# EAGLE board DF32-revision-B (EAGLE 6.6.0), part 1 of 3
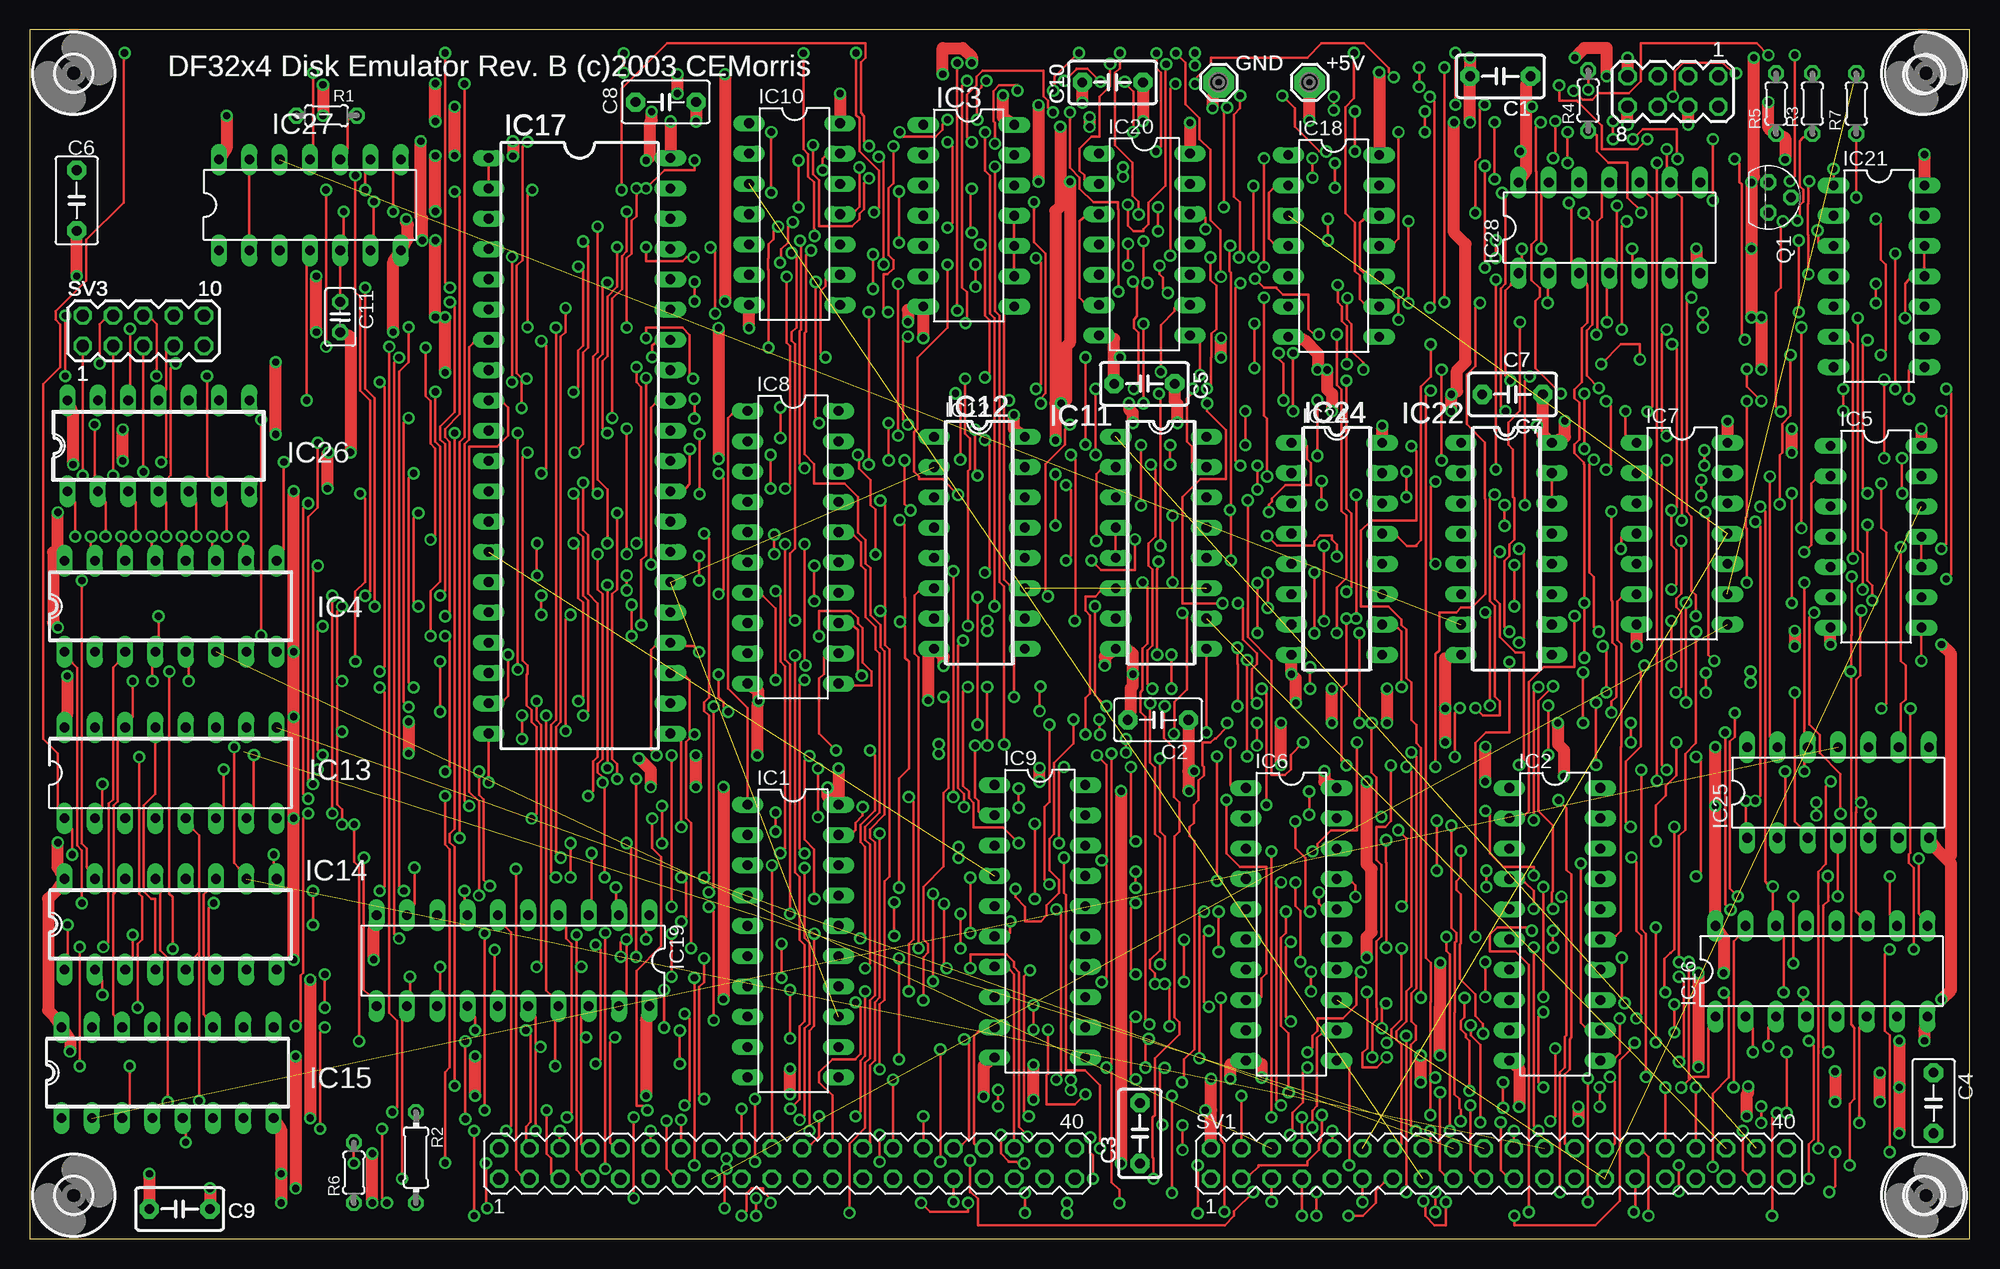
[diagram p2: board, top side]
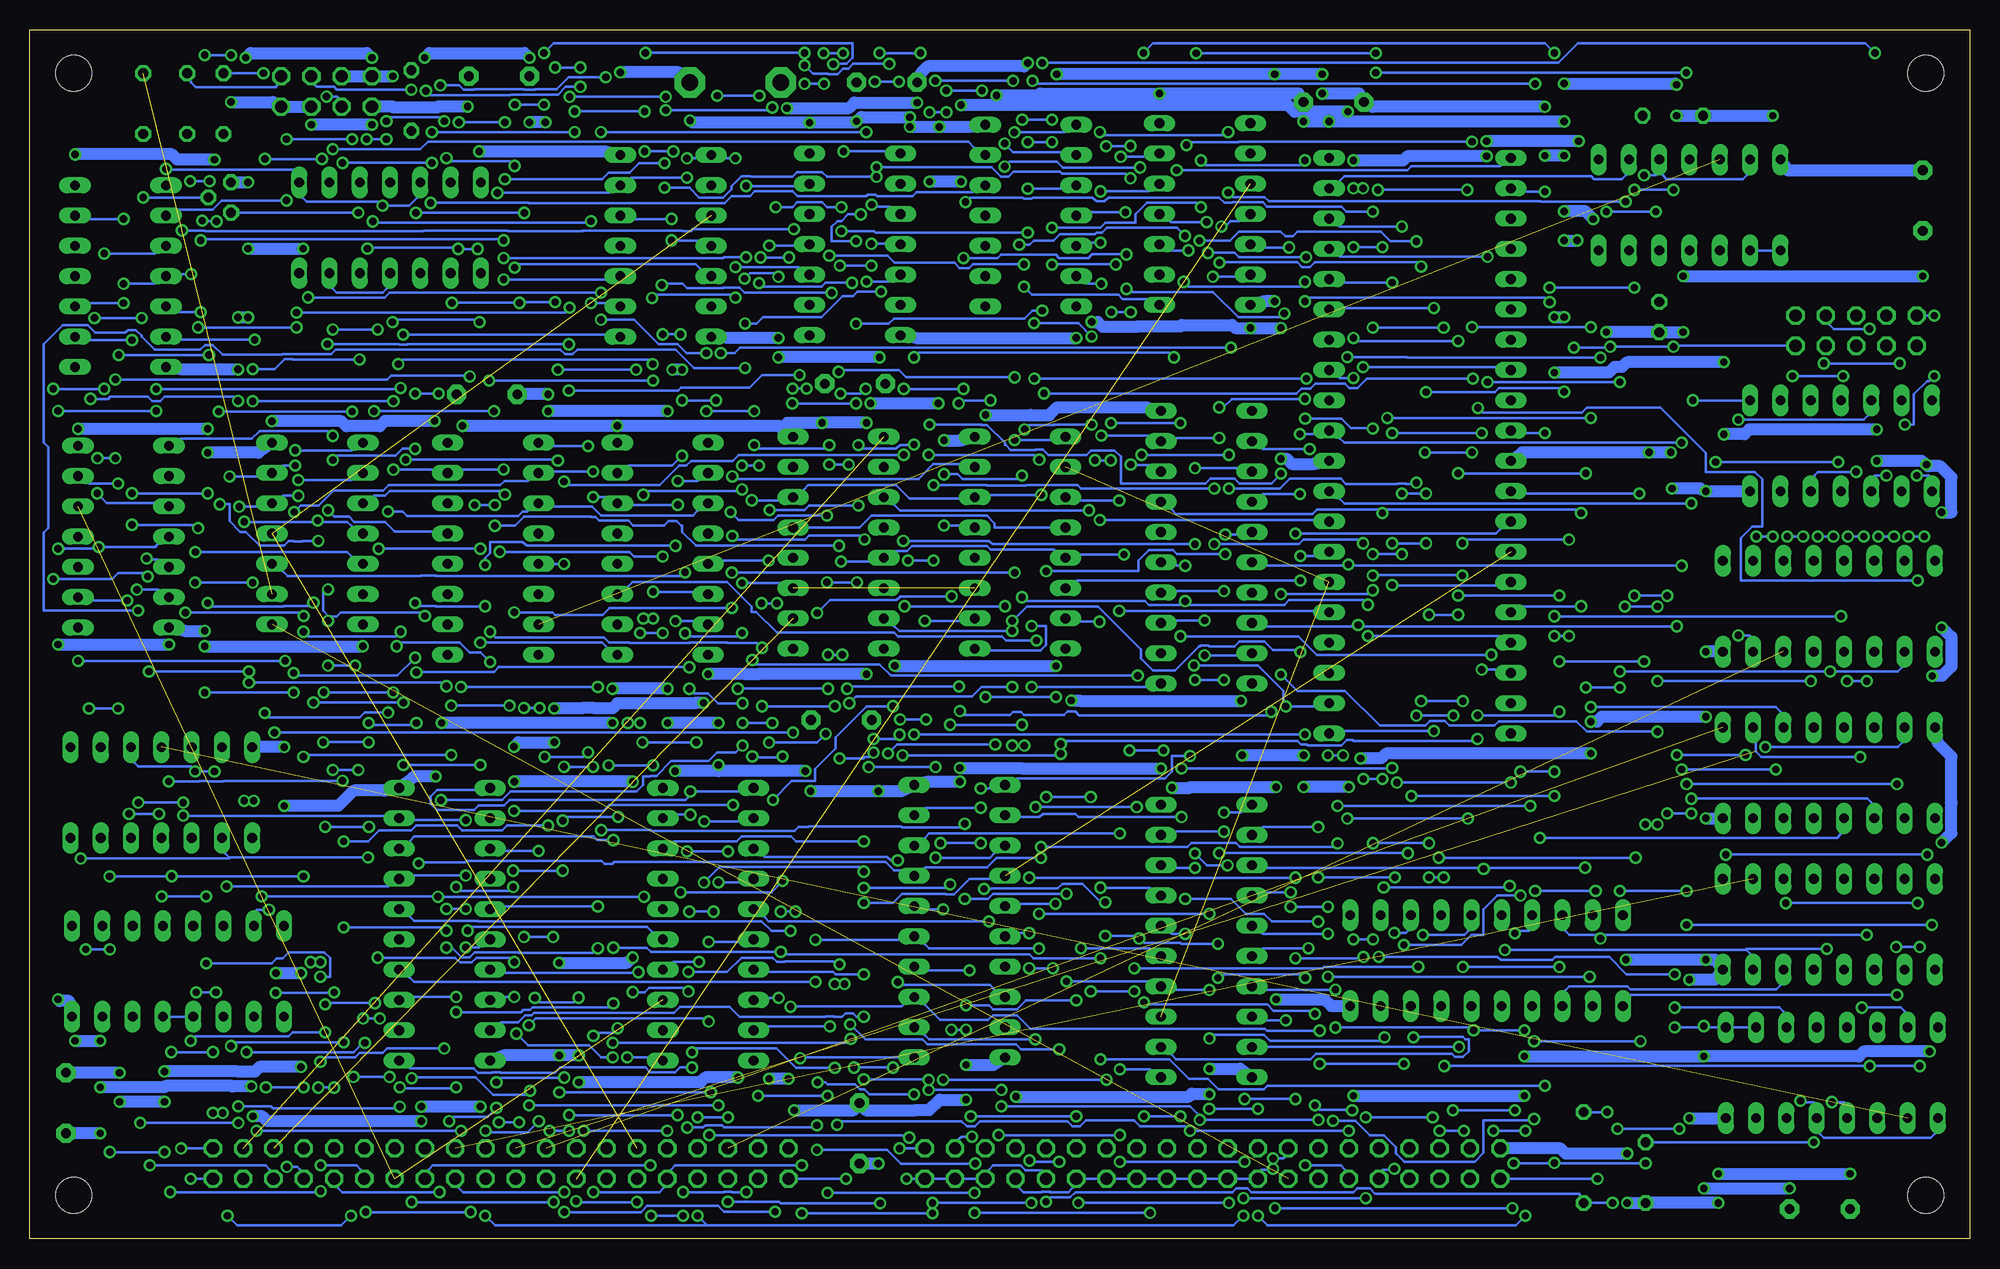
[diagram p3: board, bottom side, seen from below]

Size 162.67 x 101.4 mm. Coordinates in mm from the lower left corner, seen from the top.
Outline: 0,0 162.67,0 162.67,101.4 0,101.4 0,0
Copper layers (1*16): Top 0.035mm / dielectric 1.5mm / Bottom 0.035mm
Design rules "default *": minimum track width 8mil, minimum drill 24mil, track to track 8mil, track to pad 8mil, pad to pad 8mil, via to via 8mil, smd to smd 8mil, copper to edge 40mil, drill to drill 8mil, minimum pad ring 10mil, minimum via ring 8mil, stop-mask expansion 4mil, vias tented up to drill 0mil, thermal gap 10mil
Net classes: 1 supply: width 1.016 mm

## Footprints (pad centres in the part's own frame; a part is rotated, then mirrored left to right if it is on the bottom)
SE14 = drill 1.397 pad 2.54 octagon: MP 0,0
C5B3.5 = drill 0.813 pad 1.6 octagon: 1 -2.54,0; 2 2.54,0
C025-025X050 = drill 0.813 octagon: 1 -1.27,0; 2 1.27,0
DIL20 = drill 0.813 long: 1 -11.43,-3.81; 2 -8.89,-3.81; 3 -6.35,-3.81; 4 -3.81,-3.81; 5 -1.27,-3.81; 6 1.27,-3.81; 7 3.81,-3.81; 8 6.35,-3.81; 9 8.89,-3.81; 10 11.43,-3.81; 11 11.43,3.81; 12 8.89,3.81; 13 6.35,3.81; 14 3.81,3.81; 15 1.27,3.81; 16 -1.27,3.81; 17 -3.81,3.81; 18 -6.35,3.81; 19 -8.89,3.81; 20 -11.43,3.81
DIL14 = drill 0.813 long: 1 -7.62,-3.81; 2 -5.08,-3.81; 3 -2.54,-3.81; 4 0,-3.81; 5 2.54,-3.81; 6 5.08,-3.81; 7 7.62,-3.81; 8 7.62,3.81; 9 5.08,3.81; 10 2.54,3.81; 11 0,3.81; 12 -2.54,3.81; 13 -5.08,3.81; 14 -7.62,3.81
DIL16 = drill 0.813 long: 1 -8.89,-3.81; 2 -6.35,-3.81; 3 -3.81,-3.81; 4 -1.27,-3.81; 5 1.27,-3.81; 6 3.81,-3.81; 7 6.35,-3.81; 8 8.89,-3.81; 9 8.89,3.81; 10 6.35,3.81; 11 3.81,3.81; 12 1.27,3.81; 13 -1.27,3.81; 14 -3.81,3.81; 15 -6.35,3.81; 16 -8.89,3.81
DIL40 = drill 0.813 long: 1 -24.13,-7.62; 2 -21.59,-7.62; 3 -19.05,-7.62; 4 -16.51,-7.62; 5 -13.97,-7.62; 6 -11.43,-7.62; 7 -8.89,-7.62; 8 -6.35,-7.62; 9 -3.81,-7.62; 10 -1.27,-7.62; 11 1.27,-7.62; 12 3.81,-7.62; 13 6.35,-7.62; 14 8.89,-7.62; 15 11.43,-7.62; 16 13.97,-7.62; 17 16.51,-7.62; 18 19.05,-7.62; 19 21.59,-7.62; 20 24.13,-7.62; 21 24.13,7.62; 22 21.59,7.62; 23 19.05,7.62; 24 16.51,7.62; 25 13.97,7.62; 26 11.43,7.62; 27 8.89,7.62; 28 6.35,7.62; 29 3.81,7.62; 30 1.27,7.62; 31 -1.27,7.62; 32 -3.81,7.62; 33 -6.35,7.62; 34 -8.89,7.62; 35 -11.43,7.62; 36 -13.97,7.62; 37 -16.51,7.62; 38 -19.05,7.62; 39 -21.59,7.62; 40 -24.13,7.62
TO92 = drill 0.813 octagon: 1 1.27,0; 2 0,1.905; 3 -1.27,0
0204/5 = drill 0.813 octagon: 1 -2.54,0; 2 2.54,0
0204/7 = drill 0.813 octagon: 1 -3.81,0; 2 3.81,0
MA20-2 = drill 1.016 octagon: 1 -24.13,-1.27; 2 -24.13,1.27; 3 -21.59,-1.27; 4 -21.59,1.27; 5 -19.05,-1.27; 6 -19.05,1.27; 7 -16.51,-1.27; 8 -16.51,1.27; 9 -13.97,-1.27; 10 -13.97,1.27; 11 -11.43,-1.27; 12 -11.43,1.27; 13 -8.89,-1.27; 14 -8.89,1.27; 15 -6.35,-1.27; 16 -6.35,1.27; 17 -3.81,-1.27; 18 -3.81,1.27; 19 -1.27,-1.27; 20 -1.27,1.27; 21 1.27,-1.27; 22 1.27,1.27; 23 3.81,-1.27; 24 3.81,1.27; 25 6.35,-1.27; 26 6.35,1.27; 27 8.89,-1.27; 28 8.89,1.27; 29 11.43,-1.27; 30 11.43,1.27; 31 13.97,-1.27; 32 13.97,1.27; 33 16.51,-1.27; 34 16.51,1.27; 35 19.05,-1.27; 36 19.05,1.27; 37 21.59,-1.27; 38 21.59,1.27; 39 24.13,-1.27; 40 24.13,1.27
MA05-2 = drill 1.016 octagon: 1 -5.08,-1.27; 2 -5.08,1.27; 3 -2.54,-1.27; 4 -2.54,1.27; 5 0,-1.27; 6 0,1.27; 7 2.54,-1.27; 8 2.54,1.27; 9 5.08,-1.27; 10 5.08,1.27
MA04-2 = drill 1.016 octagon: 1 -3.81,-1.27; 2 -3.81,1.27; 3 -1.27,-1.27; 4 -1.27,1.27; 5 1.27,-1.27; 6 1.27,1.27; 7 3.81,-1.27; 8 3.81,1.27
3,0 = hole 3: 0,0

## Placement (x,y rotation side)
+5V  SE14  [SE14]  107.31,96.99 0 top
C1  [C5B3.5]  123.31,97.5 180 top
C2  [C5B3.5]  94.61,43.52 180 top
C3  [C5B3.5]  93.09,8.85 90 top
C4  [C5B3.5]  159.63,11.39 270 top
C5  [C5B3.5]  93.47,71.72 180 top
C6  [C5B3.5]  3.93,87.08 270 top
C7  [C5B3.5]  124.33,70.83 180 top
C8  [C5B3.5]  53.34,95.34 180 top
C9  [C5B3.5]  12.57,2.5 180 top
C10  [C5B3.5]  90.8,96.99 180 top
C11  [C025-025X050]  26.03,77.31 270 top
GND  SE14  [SE14]  99.69,96.99 0 top
IC1  74LS240N  [DIL20]  64,24.98 270 top
IC2  74LS244N  [DIL20]  127.88,26.38 270 top
IC3  74LS00N  [DIL14]  78.73,85.81 270 top
IC4  74LS138N  [DIL16]  11.81,53.05 0 top
IC5  74LS32N  [DIL14]  154.81,58.89 270 top
IC6  74LS244N  [DIL20]  105.79,26.38 270 top
IC7  74LS74N  [DIL14]  138.55,59.14 270 top
IC8  74LS240N  [DIL20]  64,58 270 top
IC9  74LS240N  [DIL20]  84.7,26.63 270 top
IC10  74LS04N  [DIL14]  64.13,85.94 270 top
IC11  74LS191N  [DIL16]  94.86,58.38 270 top
IC12  74LS191N  [DIL16]  79.62,58.38 270 top
IC13  74LS191N  [DIL16]  11.81,39.08 0 top
IC14  74LS191N  [DIL16]  11.81,26.38 0 top
IC15  74LS191N  [DIL16]  11.55,13.93 0 top
IC16  74LS191N  [DIL16]  150.24,22.44 0 top
IC17  DS1258  [DIL40]  46.1,66.51 270 top
IC18  74LS74N  [DIL14]  109.34,83.27 270 top
IC19  74LS240N  [DIL20]  40.51,23.33 180 top
IC20  74LS02N  [DIL14]  93.47,83.4 270 top
IC21  74LS01N  [DIL14]  155.06,80.73 270 top
IC22  74LS155N  [DIL16]  123.82,57.87 270 top
IC24  74LS155N  [DIL16]  109.6,57.87 270 top
IC25  74LS74N  [DIL14]  151.63,37.43 0 top
IC26  74LS30N  [DIL14]  10.79,66.51 0 top
IC27  74LS86N  [DIL14]  23.49,86.7 0 top
IC28  74LS07N  [DIL14]  132.46,84.8 0 top
Q1  2N3904  [TO92]  145.79,87.34 270 top
R1  1K  [0204/5]  24.89,94.2 0 top
R2  1K  [0204/7]  32.38,6.82 270 top
R3  220  [0204/5]  149.47,95.21 90 top
R4  220  [0204/5]  130.68,95.47 90 top
R5  220  [0204/5]  146.43,95.21 270 top
R6  0  [0204/5]  27.17,5.55 90 top
R7  4.7K  [0204/5]  153.16,95.21 270 top
SV1  BUS1  [MA20-2]  123.19,6.31 0 top
SV2  BUS2  [MA20-2]  63.49,6.31 0 top
SV3  WRLOCK  [MA05-2]  9.52,76.16 0 top
SV4  PANEL LEDS  [MA04-2]  137.79,96.23 180 top
U$1  [3,0]  3.68,97.75 0 top
U$2  [3,0]  3.68,3.65 0 top
U$3  [3,0]  159,3.65 0 top
U$4  [3,0]  159,97.75 0 top

## Tracks (layer width: path | path; a pad name or v marks a point on that pad's centre or on a via)
0V  (via drill 0.61)
  Top 0.203: v58.41,6.74 v58.41,5.88 58.26,5.37 v58.26,2.58 | 14.13,23.93 14.19,23.99 14.19,33.85 13.71,34.33 IC13.5 | 14.13,23.93 13.71,23.51 IC14.5 | v13.08,8.09 13.08,8.8 IC15.5 | v14.19,11.57 14.19,23.86 14.13,23.93 | v38.35,2.58 38.25,2.68 v38.25,6.34 | R6.2 v27.17,6.34 | IC11.5 IC11.4 | v140.15,63.64 v140.15,62.32 | v147.06,20.66 147.06,25.31 IC16.14 146.17,27.57 v146.17,29.55 145.69,29.78 145.51,29.96 145.51,61 v145.11,61.41 | v148.71,20.66 148.71,19.95 IC16.4 | v94.64,56.81 94.56,56.73 94.56,56.17 94.53,56.15 v94.53,48.98 | v95.73,46.14 v95.73,48.98 | v103.3,46.14 103.7,45.73 v103.7,36.39 | v122.07,35.88 122.45,35.5 122.45,32.32 123.57,31.2 126.11,31.2 v126.11,30.47 | v34.82,6.36 34.82,13.98 35.22,14.39 35.22,32.68 34.82,33.08 v34.82,37.15 | v46.81,37.15 47.21,37.55 47.21,40.02 47.62,40.42 47.62,53.3 46.81,54.12 46.81,59.02 46.4,59.42 v46.4,63.41 | v62.12,65.75 v62.12,62.93 | v69.44,65.75 69.54,65.65 69.54,64.58 70.48,63.64 70.48,63.28 70.51,63.26 70.51,61.56 70.91,61.15 v70.91,57.39
  Bottom 0.203: SV2.33 79.7,4.28 79.34,3.92 77.82,3.92 77.8,3.95 77.14,3.95 77.11,3.92 75.59,3.92 75.23,4.28 SV2.29 SV2.27 SV2.25 SV2.23 SV2.21 SV2.19 SV2.17 59.38,5.8 58.49,5.8 v58.41,5.88 | v58.41,6.74 57.53,6.74 57.45,6.82 SV2.16 | IC15.1 2.92,8.8 3.25,8.47 12.24,8.47 12.57,8.8 IC15.5 13.08,11.44 14.07,11.44 v14.19,11.57 | v13.08,8.09 R6.2 | v38.35,2.58 v58.26,2.58 | v27.17,6.34 34.82,6.34 | 34.82,6.34 v38.25,6.34 | v140.15,62.32 141.42,62.32 IC7.12 143.66,61.41 v145.11,61.41 | v140.15,63.64 135.73,63.64 IC7.2 | IC16.5 IC16.4 | v148.71,20.66 v147.06,20.66 | v146.17,29.55 132.63,29.55 IC2.17 130.4,30.47 v126.11,30.47 | v94.64,56.81 92.32,56.81 IC11.5 90.06,57.7 89.1,57.7 88.69,58.1 82.39,58.1 82.11,57.82 76.78,57.82 76.73,57.77 IC12.5 74.52,57.39 v70.91,57.39 | v95.73,48.98 v94.53,48.98 | v95.73,46.14 95.75,46.17 103.27,46.17 v103.3,46.14 | v103.7,36.39 114.09,36.39 114.6,35.88 v122.07,35.88 | v46.81,37.15 v34.82,37.15 | v46.4,63.41 46.5,63.31 47.26,63.31 47.29,63.34 47.95,63.34 47.98,63.31 52.29,63.31 52.72,63.74 57.02,63.74 57.83,62.93 v62.12,62.93 | v69.44,65.75 v62.12,65.75 | v34.82,6.36 34.82,6.34
!660-663  (via drill 0.61)
  Top 0.203: v115.44,62.22 v115.44,64.35 | v141.24,48.48 140.74,48.98 140.74,60.72 v140.51,60.95 | v158.62,48.48 IC5.8 | v108.33,61.56 v108.33,63.56
  Bottom 0.203: v115.44,64.35 118.72,64.35 IC22.2 120.92,63.56 122.86,63.56 123.21,63.21 132.58,63.21 133.04,62.75 137.18,62.75 138.45,61.48 139.97,61.48 v140.51,60.95 | v115.44,62.22 114.45,62.22 IC24.14 112.11,61.56 v108.33,61.56 | v141.24,48.48 v158.62,48.48 | v108.33,63.56 106.7,63.56 IC24.2
!(NED+EWL)  (via drill 0.61)
  Top 0.203: v94.43,91.2 94.84,91.61 94.84,97.8 94.48,98.16 v94.48,99.43 | v96.11,99.43 96.9,98.64 96.9,95.16 98.09,93.97 98.09,92.24 99,91.33 99,85.43 99.84,84.59 99.84,80.73 v99.89,80.68 | v102.74,80.53 103.5,79.77 104.52,79.77 104.52,79.74 105.08,79.19 107.23,79.19 107.23,76.31 107.69,75.86 v108.1,75.86 | v109.6,75.86 109.6,71.62 110,71.21 110,61.05 110.41,60.64 110.41,55.44 109.6,54.62 v109.6,50.81 | v111.5,43.27 v111.5,50.81 | v112.52,43.27 112.52,39.1 112.92,38.7 112.92,35.8 v113.33,35.4 | v117.98,30.87 v117.98,35.07 | v122.14,29.5 v122.14,30.87 | v126.92,20.28 v126.92,29.5
  Bottom 0.203: v94.43,91.2 90.95,91.2 IC20.1 | v96.11,99.43 v94.48,99.43 | v99.89,80.68 100.2,80.99 102.28,80.99 v102.74,80.53 | v109.6,75.86 v108.1,75.86 | v111.5,50.81 v109.6,50.81 | v112.52,43.27 v111.5,43.27 | v113.33,35.4 117.65,35.4 v117.98,35.07 | v122.14,30.87 v117.98,30.87 | v122.14,29.5 122.47,29.17 126.59,29.17 v126.92,29.5 | v126.92,20.28 130.4,20.28 IC2.13
!ACBUS0  (via drill 0.61)
  Top 0.203: v67.61,40.96 66.19,42.38 66.19,46.98 66.59,47.38 66.59,48.76 IC8.12 | v70.45,40.96 70.86,40.55 70.86,35.93 69.64,34.71 69.64,33.29 70.05,32.88 70.05,25.59 v69.64,25.18 | v63.04,21.88 v63.04,24.75 | v55.72,6.16 v55.72,21.88 | v120.01,32.53 120.01,30.39 119.6,29.98 119.6,29.27 120.01,28.87 120.01,24.78 119.91,24.68 119.91,21.81 121.23,20.48 121.23,18.68 121.86,18.05 v121.86,17.21 | v113.79,15.23 112.95,14.39 111.76,14.39 111.76,15.58 112.16,15.99 112.16,20.64 v112.11,20.69 | v107.44,22.39 v107.44,20.74 | v94.76,23.02 95.17,23.43 95.17,33.74 94.76,34.15 v94.76,40.3 | v91.92,41.92 v91.92,40.78 | v89.73,42.28 89.68,42.33 v89.68,43.55 | v87.52,43.55 87.52,41.54 85.9,39.92 85.9,33.95 85.49,33.54 85.49,30.9 86.3,30.09 86.3,29.02 85.26,27.98 85.26,27.11 84.78,26.63 83.46,26.63 83.46,27.85 82.65,28.66 v82.65,29.35 | v72.49,25.41 v72.49,28.23
  Bottom 0.203: v70.45,40.96 v67.61,40.96 | v63.04,24.75 66.11,24.75 66.16,24.8 69.26,24.8 v69.64,25.18 70.12,25.41 v72.49,25.41 | v63.04,21.88 62.73,22.19 56.03,22.19 v55.72,21.88 | v55.72,6.16 52.72,6.16 52.37,5.8 SV2.11 | v120.01,32.53 122.78,32.53 IC2.3 | v121.86,17.21 120.87,16.22 115.77,16.22 114.78,15.23 v113.79,15.23 | v112.11,20.69 111.09,20.69 110.74,21.04 107.74,21.04 v107.44,20.74 | v107.44,22.39 104.19,22.39 102.99,23.58 100.38,23.58 100.02,23.23 99.36,23.23 99.33,23.25 94.99,23.25 v94.76,23.02 | v94.76,40.3 92.76,40.3 92.65,40.4 92.27,40.4 91.92,40.75 v91.92,40.78 | v91.92,41.92 90.09,41.92 v89.73,42.28 | v87.52,43.55 v89.68,43.55 | v82.65,29.35 82.06,29.35 82.04,29.38 76.5,29.38 76.09,29.78 74.39,29.78 72.84,28.23 v72.49,28.23
!ACBUS1  (via drill 0.61)
  Top 0.203: v48.25,5.88 v48.25,25.67 | v62.53,54.32 62.94,53.91 62.94,48.4 63.34,47.99 63.34,32.75 v62.94,32.35 | v47.11,32.35 47.11,28.46 IC19.3
  Bottom 0.203: v48.25,25.67 47.26,25.67 47.11,25.82 IC19.3 | v48.25,5.88 48.33,5.8 49.22,5.8 SV2.9 | v62.53,54.32 66.52,54.32 IC8.14 | v47.11,32.35 v62.94,32.35
!ACBUS2  (via drill 0.61)
  Top 0.203: 45.84,22.82 45.84,5.78 46.25,5.37 SV2.7 | 45.84,22.82 v45.84,25.49 | v70.05,22.7 70.45,23.1 70.45,33.06 70.05,33.47 70.05,34.53 71.27,35.75 71.27,49.09 70.91,49.44 70.91,51.32 70.1,52.13 70.1,56.07 69.69,56.48 69.69,58.41 69.11,58.99 IC8.16 | 45.84,22.82 v46.25,22.82
  Bottom 0.203: v45.84,25.49 42.36,25.49 42.03,25.82 IC19.5 | v70.05,22.7 54.27,22.7 54.15,22.82 v46.25,22.82
!ACBUS3  (via drill 0.61)
  Top 0.203: v36.44,29.17 36.44,28.46 IC19.7 | v31.36,29.17 30.96,29.58 30.96,72.73 31.77,73.55 v31.77,76.47 | v41.73,76.47 41.73,87.57 v42.13,87.97 | v49.63,87.97 49.63,96.46 53.44,100.27 70.1,100.27 70.1,99.07 69.69,98.67 69.69,94.42 69.97,94.15 69.97,92.06 v70.38,91.66 | v72.41,91.63 72.41,88.53 72,88.12 72,82.49 72.41,82.08 72.41,81.37 71.93,80.89 71.57,80.89 71.57,77.86 71.73,77.71 v71.98,77.71 | v70.35,64.94 v70.35,77.71 | v43.33,10.78 43.33,7.15 43.71,6.77 43.71,6.54 43.73,6.51 43.73,5.4 SV2.5 | v38.15,25.62 v38.15,10.78
  Bottom 0.203: v31.36,29.17 v36.44,29.17 | v41.73,76.47 v31.77,76.47 | v49.63,87.97 v42.13,87.97 | v70.38,91.66 70.4,91.63 v72.41,91.63 | v70.35,77.71 v71.98,77.71 | v70.35,64.94 70.33,64.91 68.83,64.91 IC8.18 | v38.15,10.78 v43.33,10.78 | v38.15,25.62 37.94,25.82 36.95,25.82 IC19.7
!ACBUS4  (via drill 0.61)
  Top 0.203: v32.25,31.13 32.25,28.08 IC19.9 | v40.76,31.03 40.76,5.78 41.17,5.37 SV2.3
  Bottom 0.203: 40.76,31.13 58.9,31.13 IC1.3 | 40.76,31.13 v32.25,31.13 | v40.76,31.03 40.76,31.13
!ACBUS5  (via drill 0.61)
  Top 0.203: v31.21,5.04 31.21,18.35 IC19.12 31.87,20.84 v31.87,21.98 | v53.82,21.98 v53.82,25.59
  Bottom 0.203: SV2.1 v31.21,5.04 | v53.82,25.59 59.28,25.59 IC1.5 | v31.87,21.98 v53.82,21.98
!ACBUS6  (via drill 0.61)
  Top 0.203: v37.33,17.49 37.33,18.58 IC19.14 | v41.6,17.49 42.01,17.08 42.01,9.82 41.6,9.41 41.6,8.34 SV2.4 | v53.18,17.72 v53.18,20.89
  Bottom 0.203: v37.33,17.49 v41.6,17.49 42.08,17.72 v53.18,17.72 | v53.18,20.89 58.9,20.89 IC1.7
!ACBUS7  (via drill 0.61)
  Top 0.203: v42.41,9.05 42.41,16.09 | 42.41,16.09 42.41,18.58 IC19.16 | v44.45,9.05 SV2.6 | 42.41,16.09 v42.82,16.09
  Bottom 0.203: v44.45,9.05 v42.41,9.05 | v42.82,16.09 IC1.9
!ACBUS8  (via drill 0.61)
  Top 0.203: 46.25,16.9 46.25,18.55 IC19.18 | 46.25,16.9 46.25,7.91 SV2.8 | 46.25,16.9 v46.65,16.9
  Bottom 0.203: v46.65,16.9 46.63,16.93 42.49,16.93 42.29,16.73 42.01,16.73 42.01,15.73 42.49,15.25 43.15,15.25 43.4,15.51 54.83,15.51 55.27,15.07 66.54,15.07 66.9,15.43 IC1.12
!ACBUS9  (via drill 0.61)
  Top 0.203: v49.07,16.9 48.66,16.5 48.66,8.04 48.79,7.91 SV2.10 | v63.75,20.87 v63.75,16.8 | v115.03,27.88 115.44,28.28 115.44,33.59 v114.75,34.28 | v84.27,28.51 v84.27,34.81 | v75.74,21.6 v75.74,28.94
  Bottom 0.203: v49.07,16.9 49.35,16.62 58.69,16.62 59.18,17.11 63.44,17.11 v63.75,16.8 | v63.75,20.87 66.54,20.87 IC1.14 68.96,21.6 v75.74,21.6 | v115.03,27.88 122.78,27.88 IC2.5 | v114.75,34.28 110.61,34.28 110.54,34.2 98.55,34.2 98.19,34.56 97.35,34.56 97.33,34.58 89.61,34.58 89.53,34.51 84.58,34.51 v84.27,34.81 | v84.27,28.51 82.32,28.51 81.89,28.94 v75.74,28.94
!ACBUS10  (via drill 0.61)
  Top 0.203: v65.78,25.59 65.78,17.87 65.38,17.46 v65.38,9.05 | v52.06,9.05 SV2.12 | v111.63,22.36 111.22,21.96 111.22,19.62 110.1,18.5 107.97,18.5 107.97,17.46 107.54,17.03 107.54,16.04 v107.13,15.63 | v95.17,14.34 94.76,14.34 94.76,9.77 v94.97,9.56
  Bottom 0.203: v65.78,25.59 66.9,25.59 IC1.16 | v52.06,9.05 v65.38,9.05 65.7,9.44 69.57,9.44 70.07,9.94 74.09,9.94 74.59,9.44 75.26,9.44 75.66,9.84 83,9.84 83.41,9.44 84.09,9.44 84.53,9.87 94.66,9.87 v94.97,9.56 | v111.63,22.36 111.68,22.31 122.78,22.31 IC2.7 | v107.13,15.63 106.8,15.96 100.05,15.96 98.42,14.34 v95.17,14.34
!ACBUS11  (via drill 0.61)
  Top 0.203: v64.56,9.97 64.97,10.38 64.97,17.64 65.38,18.05 65.38,24.83 64.97,25.23 v64.97,31.1 | v54.6,9.97 SV2.14 | v92.73,18.63 92.32,18.23 92.32,13.78 v92.73,13.37 | v87.3,12.48 v87.3,13.32 | v81.2,11.11 v81.2,12.48
  Bottom 0.203: v54.6,9.97 v64.56,9.97 64.77,10.48 65.4,11.11 v81.2,11.11 | v64.97,31.1 66.52,31.1 IC1.18 | v92.73,18.63 93.34,18.63 93.62,18.91 94.28,18.91 94.56,18.63 95.22,18.63 95.25,18.66 95.91,18.66 95.96,18.61 103.14,18.61 103.98,19.44 108.15,19.44 108.66,18.94 120.39,18.94 120.57,18.76 121.15,18.76 121.74,18.17 123.13,18.17 123.16,18.15 IC2.9 | v92.73,13.37 87.35,13.37 v87.3,13.32 | v81.2,12.48 v87.3,12.48
!ACCLEAR  (via drill 0.61)
  Top 0.203: v133.09,86.65 133.09,81.93 IC28.4 132.25,79.69 v132.25,76.87 | v151.25,89.73 IC21.1 | v94.23,5.04 94.23,6.74 94.15,6.82 94.15,10.17 94.36,10.38 94.36,15.13 96.39,17.16 96.39,18.17 95.98,18.58 95.98,33.74 96.39,34.15 96.39,36.61 95.93,37.07 95.93,41.19 95.12,42 95.12,44.62 v95.17,44.67 | v101.27,44.67 101.29,44.69 101.29,48.17 101.27,48.2 v101.27,49.57 | v124.07,50.91 123.67,51.32 123.67,56.86 124.07,57.26 124.07,58.23 124.48,58.64 124.48,62.12 124.38,62.22 124.38,66.2 123.97,66.61 123.97,68.47 124.96,69.46 v124.96,76.87
  Bottom 0.203: IC28.4 132.74,79.69 133.07,79.36 136.93,79.36 137.26,79.69 IC28.6 | IC28.12 130.19,87.31 130.86,86.65 v133.09,86.65 133.47,86.98 139.47,86.98 139.8,87.31 IC28.8 140.58,89.67 151.2,89.67 v151.25,89.73 | v101.27,44.67 v95.17,44.67 | v101.27,49.57 101.67,49.98 104.16,49.98 104.19,50 107.34,50 107.36,49.98 112.39,49.98 112.42,50 114.09,50 114.52,50.43 123.59,50.43 v124.07,50.91 | v124.96,76.87 125.17,77.08 132.05,77.08 v132.25,76.87 | v94.23,5.04 SV1.1
!BADDAC  (via drill 0.61)
  Top 0.203: v116.23,9.05 115.82,9.46 115.82,16.27 116.23,16.68 116.23,17.84 115.84,18.23 115.84,20.59 116.25,20.99 116.25,40.4 v115.84,40.81 | v119.5,40.42 119.5,44.11 v119.91,44.51 | v121.23,44.51 121.86,43.88 123.26,43.88 123.26,45.07 122.86,45.48 122.86,53.07 122.45,53.48 122.45,62.04 v122.83,62.42 | v109.22,9.05 SV1.10
  Bottom 0.203: v116.23,9.05 v109.22,9.05 | v115.84,40.81 116.23,40.42 v119.5,40.42 | v121.23,44.51 v119.91,44.51 | v122.83,62.42 123.13,62.73 132.48,62.73 132.89,62.32 133.8,62.32 IC7.3
!BBREAK  (via drill 0.61)
  Top 0.203: v104.11,32.5 v104.11,10.2 | v107.56,32.5 107.97,32.91 107.97,33.13 109.09,34.25 111.3,34.25 v111.3,41.64 | v106.78,41.64 105.73,40.6 105.73,39.38 105.25,38.9 104.11,38.9 104.11,48.48 102.13,50.46 v102.13,61.94 | v106.68,10.2 SV1.8 | v66.49,89.62 66.49,90.59 66.65,90.74 IC10.13 | IC17.1 IC17.2 | v8.63,46.77 8.63,43.83 IC13.14 7.39,41.92 7.39,36.69 7.03,36.34 7.03,29.04 7.09,28.98 | v10.28,46.77 10.28,47.92 IC4.4 10.79,50.56 v10.79,52.21 | 7.09,28.98 6.98,28.87 6.98,18.81 7.11,18.68 IC15.14 | 7.09,28.98 7.36,29.25 IC14.14 | v35.63,87.82 36.04,87.41 36.04,69.15 34.82,67.93 34.82,67.22 35.22,66.81 35.22,52.62 v34.82,52.21 | v77.85,62.4 76.53,63.72 74.57,63.72 74.57,63.95 74.16,64.35 74.16,67.65 74.44,67.93 74.44,73.9 76.96,76.42 v76.96,81.7 | v71.6,81.73 71.6,90.34 v71.19,90.74
  Bottom 0.203: v104.11,10.2 v106.68,10.2 | v107.56,32.5 v104.11,32.5 | v106.78,41.64 v111.3,41.64 | v102.13,61.94 99.97,61.94 IC11.14 97.76,62.85 97.4,63.21 90.04,63.21 88.9,62.07 84.73,62.07 IC12.14 82.14,62.4 v77.85,62.4 | v66.49,89.62 47.16,89.62 46.81,89.98 39.39,89.98 IC17.1 | v10.28,46.77 v8.63,46.77 | v35.63,87.82 37.18,87.82 IC17.2 | v10.79,52.21 v34.82,52.21 | v76.96,81.7 76.93,81.73 v71.6,81.73 | v71.19,90.74 69.23,90.74 IC10.13
!BRK_RQ  (1 unrouted)
!BWCO  (2 unrouted)
!DATA0  (via drill 0.61)
  Top 0.203: v64.16,48.93 64.16,30.75 64.56,30.34 64.56,25.06 64.97,24.65 64.97,18.23 64.56,17.82 64.56,11.7 v63.77,10.91 | SV2.18 v59.68,10.91
  Bottom 0.203: v64.16,48.93 61.49,48.93 IC8.9 | v59.68,10.91 v63.77,10.91
!DATA1  (via drill 0.61)
  Top 0.203: v62.53,46.88 62.53,52.87 61.49,53.91 IC8.7 | v64.97,46.88 64.56,46.47 64.56,32.73 v64.97,32.32 | SV2.20 v62.22,31.33
  Bottom 0.203: v64.97,46.88 v62.53,46.88 | v64.97,32.32 63.98,31.33 v62.22,31.33
!DATA2  (via drill 0.61)
  Top 0.203: v62.43,57.42 v62.43,59.07 | v77.44,37.05 v77.44,55.99 | v73.71,37.05 74.11,36.64 74.11,25.13 73.71,24.73 v73.71,20.77 | v70.05,20.77 70.05,15.33 69.64,14.92 69.64,10.68 v69.23,10.27 | v66.19,10.27 66.19,8.6 65.5,7.91 SV2.22
  Bottom 0.203: v62.43,59.07 61.49,59.07 IC8.5 | v62.43,57.42 66.47,57.42 66.8,57.75 68.83,57.75 69.69,56.88 69.69,55.99 v77.44,55.99 | v73.71,37.05 v77.44,37.05 | v70.05,20.77 v73.71,20.77 | v66.19,10.27 v69.23,10.27
!DATA3  (via drill 0.61)
  Top 0.203: v69.23,19.82 69.64,19.42 69.64,15.51 69.23,15.1 69.23,15.07 67.31,15.07 66.19,13.96 66.19,13.14 67.31,12.03 SV2.24 | v54.91,18.86 55.32,18.45 55.32,11.59 v54.91,11.19 | v51.79,10.78 51.4,11.16 50.87,11.16 50.87,22.49 52.95,24.57 52.95,32.04 52.19,32.8 v52.19,35.24 | v42.08,35.24 42.49,35.65 42.49,42.94 42.08,43.35 42.08,44.34 41.68,44.74 41.68,47.33 41.73,47.38 41.73,48.1 41.32,48.5 41.32,65.55 v41.73,65.95 | v45.69,65.95 46.4,66.66 46.4,74.33 46.81,74.74 46.81,83.25 v46.4,83.66 | v64.59,83.71 64.69,83.6 64.69,76.26 64.56,76.14 64.56,65.04 v64.97,64.63
  Bottom 0.203: v69.23,19.82 69.06,19.65 58.9,19.65 58.39,19.14 55.19,19.14 v54.91,18.86 | v54.91,11.19 54.53,10.81 51.81,10.81 v51.79,10.78 | v42.08,35.24 v52.19,35.24 | v45.69,65.95 v41.73,65.95 | v46.4,83.66 48.56,83.66 49.37,84.47 56.36,84.47 56.74,84.09 57.4,84.09 57.78,84.47 61.28,84.47 62.05,83.71 v64.59,83.71 | v64.97,64.63 61.49,64.63 IC8.3
!DATA4  (via drill 0.61)
  Top 0.203: v71.27,34 71.27,20.23 70.86,19.82 70.86,14.97 70.45,14.57 70.45,8.04 SV2.26
  Bottom 0.203: v71.27,34 87.24,34 87.6,33.64 IC9.18
!DATA5  (via drill 0.61)
  Top 0.203: v86.08,27.62 86.48,27.22 86.48,13.75 v86.08,13.35 | SV2.28 v72.39,13.35
  Bottom 0.203: v86.08,27.62 87.22,27.62 IC9.16 | v72.39,13.35 v86.08,13.35
!DATA6  (via drill 0.61)
  Top 0.203: v83.87,22.52 83.36,22.01 83.36,10.68 v83.76,10.27 | SV2.30 v74.93,10.27
  Bottom 0.203: v83.87,22.52 87.24,22.52 IC9.14 | v74.93,10.27 v83.76,10.27
!DATA7  (via drill 0.61)
  Top 0.203: v78.35,16.73 78.76,16.32 78.76,8.47 78.2,7.91 SV2.32
  Bottom 0.203: v78.35,16.73 87.24,16.73 87.6,17.08 IC9.12
!DATA8
  Top 0.203: IC9.9 79.6,17.46 79.17,17.03 79.17,8.01 79.27,7.91 SV2.34
!DATA9
  Top 0.203: IC9.7 82.19,22.54 82.55,22.19 SV2.36
!DATA10  (via drill 0.61)
  Top 0.203: v83.66,8.57 83.66,8.67 82.95,9.38 82.95,22.36 82.52,22.8 82.52,23.23 81.91,23.84 78.86,23.84 v78.86,22.7 | v76.88,22.7 76.65,22.92 v76.65,28.11
  Bottom 0.203: v83.66,8.57 84.55,8.57 84.78,8.34 SV2.38 | v76.88,22.7 v78.86,22.7 | v76.65,28.11 79.6,28.11 IC9.5
!DATA11  (via drill 0.61)
  Top 0.203: v89.73,7.58 89.73,12.89 88.49,14.13 86.89,14.13 86.89,28.84 86.71,29.02 v86.71,31.97
  Bottom 0.203: v86.71,31.97 82.16,31.97 81.81,32.32 IC9.3 | v89.73,7.58 SV2.40
!DRL
  Top 0.203: IC7.6 133.45,53.79 133.12,53.45 133.12,50.2 133.45,49.87 133.45,41.26 133.42,41.24 133.42,25.82 132.99,25.39 IC2.15
!EA  (via drill 0.61)
  Top 0.203: v95.78,3.85 v95.78,12 | v83.46,2.17 v83.46,3.85 | v68.73,2.17 68.73,7.99 70.05,9.31 70.05,14.74 70.45,15.15 70.45,20 70.86,20.41 70.86,33.24 70.45,33.64 70.45,34.35 71.67,35.57 71.67,49.26 71.32,49.62 71.32,51.5 70.51,52.31 70.51,56.25 70.1,56.66 70.1,58.59 69.44,59.25 69.44,62.22 68.32,63.34 65.78,63.34 65.78,64.99 64.97,65.8 64.97,75.96 65.09,76.09 65.09,82.49 v65.5,82.89 | v101.59,12 SV1.4
  Bottom 0.203: v95.78,12 v101.59,12 | v83.46,3.85 v95.78,3.85 | v68.73,2.17 v83.46,2.17 | v65.5,82.89 66.87,82.89 IC10.10
!EWL  (via drill 0.61)
  Top 0.203: v131.36,75.83 131.44,75.91 131.44,85.31 131.82,85.69 131.82,87.67 IC28.11
  Bottom 0.203: v131.36,75.83 114.45,75.83 IC18.8
!INT_RQ  (via drill 0.61)
  Top 0.203: v117.45,9.05 117.45,8.04 SV1.16 | v119.07,9.05 119.07,19.14 119.1,19.16 119.1,23.86 118.79,24.17 v118.79,25.31 | v121.23,25.31 121.23,41.59 122.09,42.46 124.07,42.46 v124.07,48.37 | v131.9,49.7 132.2,49.39 v132.2,45.83 | v138.02,45.83 138.48,46.29 138.48,52.59 138.07,53 138.07,53.71 138.48,54.12 v138.48,58.53 | v146.73,61.61 146.73,65.72 146.93,65.93 146.93,68.31 147.65,69.03 v147.65,74.13 | v155.21,74.13 155.62,74.54 155.62,81.7 155.21,82.11 155.21,85.13 v154.81,85.53
  Bottom 0.203: v119.07,9.05 v117.45,9.05 | v118.79,25.31 118.82,25.34 121.2,25.34 v121.23,25.31 | v124.07,48.37 124.86,49.16 125.78,49.16 126.61,50 131.59,50 v131.9,49.7 | v138.02,45.83 v132.2,45.83 | v138.48,58.53 139.77,58.53 139.82,58.48 140.48,58.48 140.53,58.53 140.94,58.53 141.35,58.13 143.38,58.13 144.55,59.3 145.03,59.3 145.92,60.19 145.92,61.61 v146.73,61.61 | v155.21,74.13 v147.65,74.13 | v154.81,85.53 157.58,85.53 IC21.13
!IOP4  (via drill 0.61)
  Top 0.203: v62.76,84.9 62.35,84.49 62.35,83.83 61.95,83.43 61.95,82.23 61.92,82.21 61.92,81.29 61.95,81.27 v61.95,74.74 | v104.72,74.28 104.72,73.83 105.13,73.42 v105.13,70.32 | v107.97,65.67 v107.97,70.32
  Bottom 0.203: v62.76,84.9 62.4,84.9 61.97,85.33 61.28,85.33 IC10.4 | v61.95,74.74 103.09,74.74 103.55,74.28 v104.72,74.28 | v107.97,70.32 v105.13,70.32 | v107.97,65.67 108.81,64.83 112.44,64.83 IC24.15
!IOS  (via drill 0.61)
  Top 0.203: v154.81,78.47 v154.81,80.1 | v127.27,78.5 127.27,79.69 IC28.2 | v121.61,78.5 121.2,78.09 121.2,73.19 120.49,72.48 120.49,68.31 122.02,66.79 122.02,62.07 122.04,62.04 122.04,54.06 120.92,52.95 120.01,52.95 119.6,52.54 118.18,52.54 118.18,49.34 117.88,49.04 v117.88,39.59 | v115.44,39.59 115.84,39.18 115.84,21.17 115.44,20.77 115.44,18.23 114.6,17.39 114.6,16.68 115.01,16.27 115.01,7.94 SV1.14 | v149.14,80.91 149.14,84.16 149.09,84.21 149.09,86.78 149.12,86.81 149.12,88.61 v149.22,88.71 | v147.59,88.71 148,89.12 v148,99.28 | v145.79,99.28 144.8,100.27 135.1,100.27 135.1,97.09 134.08,96.08 131.49,96.08 131.49,96.03 131.01,95.54 130.25,95.54 129.51,96.28 v129.46,96.28 | v116.51,98.23 v116.51,96.61 | v118.61,78.55 v118.61,98.23
  Bottom 0.203: v154.81,80.1 152.19,80.1 IC21.4 149.96,80.91 v149.14,80.91 | v154.81,78.47 157.58,78.47 IC21.10 | v127.27,78.5 v121.61,78.5 121.13,78.55 v118.61,78.55 | v115.44,39.59 v117.88,39.59 | v147.59,88.71 v149.22,88.71 | v145.79,99.28 v148,99.28 | v129.46,96.28 129.08,95.9 122.37,95.9 122.32,95.95 118.38,95.95 117.72,96.61 v116.51,96.61 | v118.61,98.23 v116.51,98.23
!IOT601  (1 unrouted)
!IOT602  (via drill 0.61)
  Top 0.203: v148,45.81 148,35.01 148.46,34.56 IC25.3 | v140.53,47.46 v140.53,45.81 | v130.35,48.73 v130.35,53.33 130.35,64.94 130.32,64.96 130.32,65.11 129.53,65.9 129.53,66.61 129.94,67.02 129.94,70.12 129.53,70.52 129.53,71.23 130.15,71.84 130.15,76.37 130.63,76.85 130.63,79.97 130.55,80.05 IC28.3 129.28,81.93 129.28,86.65 v129.05,86.88 | v124.48,56.5 v124.48,53.05 | v108.53,51.8 v108.53,58.13
  Bottom 0.203: v140.53,45.81 v148,45.81 | v140.53,47.46 140.31,47.23 131.85,47.23 v130.35,48.73 | v130.35,53.33 130.09,53.07 128.65,53.07 128.62,53.05 v124.48,53.05 | v124.48,56.5 124.48,57.11 124.07,57.52 124.07,58.46 121.36,58.46 121.03,58.13 v108.53,58.13 | v108.53,51.8 107.08,51.8 IC24.7 | v129.05,86.88 120.87,86.88 120.85,86.86 104.41,86.86 103.81,87.47 102.28,87.47 101.87,87.87 98.7,87.87 98.29,87.47 92.5,87.47 92.4,87.57 91.74,87.57 91.64,87.47 88.64,87.47 88.31,87.8 83.56,87.8 IC3.12
!IOT604  (via drill 0.61)
  Top 0.203: v143.89,36.74 143.89,34.91 IC25.1 | v144.7,36.74 145.11,37.15 145.11,59.73 v144.7,60.14 | v124.89,50 125.29,50.41 125.29,57.47 v124.89,57.87 | v133.42,57.87 133.45,57.9 133.45,58.87 IC7.4 | v137.26,91.38 137.26,89.9 IC28.9 138.17,87.67 138.53,87.31 v138.53,60.24
  Bottom 0.203: v144.7,36.74 v143.89,36.74 | 138.53,60.14 136.04,60.14 135.68,59.78 IC7.4 | 138.53,60.14 v144.7,60.14 | v124.89,50 114.68,50 114.32,49.64 IC24.9 | v133.42,57.87 v124.89,57.87 | v137.26,91.38 129.92,91.38 129.28,92.01 83.97,92.01 83.48,91.53 IC3.13 | v138.53,60.24 138.53,60.14
!IOT612  (via drill 0.61)
  Top 0.203: v125.12,83.02 125.12,82.28 IC28.1 124.2,80.05 124.2,79.97 123.74,79.52 123.74,72.38 v124.15,71.97 | v126.74,83.02 126.74,87.67 IC28.13 | v134.36,83.05 134.36,81.93 IC28.5 | v110.41,54.27 110.81,54.67 110.81,60.82 110.41,61.23 v110.41,71.97
  Bottom 0.203: v125.12,83.02 v126.74,83.02 127.22,83.12 134.28,83.12 v134.36,83.05 | v110.41,54.27 107.08,54.27 IC24.6 | v124.15,71.97 v110.41,71.97
!IOT614  (via drill 0.61)
  Top 0.203: v50.03,25.11 50.03,20.46 IC19.19 | v51.68,25.11 51.68,25.82 IC19.1 | IC15.11 14.73,18.68 14.6,18.81 14.6,28.87 14.98,29.25 IC14.11 | v49.55,23.66 49.55,24.88 v50.03,25.11 | v24.73,19.39 v24.73,22.19 | v115.03,46.29 115.03,50.91 114.7,51.25 IC24.10 | v126.51,46.29 126.11,45.89 v126.11,35.12 | v149.8,35.5 v149.8,36.59 | IC16.11 153.41,27.19 153.13,27.47 153.13,35.75 153.16,35.78 153.16,36.18 v153.56,36.59 153.16,36.89 153.16,46.9 153.49,47.23 153.49,52.59 v153.59,52.69 | v50.03,33.19 50.44,32.78 50.44,25.41 v50.03,25.11 | v45.33,30.32 v45.33,33.19 | v44.11,30.32 43.71,30.72 43.71,43.12 44.11,43.52 v44.11,76.42 | v50.06,76.42 50.06,82.23 50.46,82.64 50.46,85.38 50.87,85.79 v50.87,88.1 | v51.68,88.1 53.21,89.62 55.75,89.62 v55.75,90.44 | v64.46,86.53 v64.46,90.44 | v76.96,84.8 77.36,85.2 77.36,91.58 v76.96,91.99 | v78.99,91.99 78.58,92.39 78.58,95.95 79.4,96.76 79.4,97.47 79.88,97.95 85.01,97.95 85.01,95.82 85.39,95.44 85.39,94.88 v85.8,94.48 | v87.22,94.48 87.22,89.83 88.03,89.01 88.03,88.08 89.17,86.93 91.26,86.93 91.26,86.37 91.28,86.35 v91.28,79.44 | v102.69,73.04 v102.69,76.77
  Bottom 0.203: v51.68,25.11 v50.03,25.11 | v49.55,23.66 39.59,23.66 39.31,23.38 35,23.38 34.74,23.63 30.22,23.63 28.77,22.19 v24.73,22.19 | v24.73,19.39 15.95,19.39 15.62,19.06 IC15.11 | v126.51,46.29 v115.03,46.29 | v126.11,35.12 130.4,35.12 IC2.19 132.99,35.47 149.78,35.47 v149.8,35.5 | v149.8,36.59 v153.56,36.59 | v45.33,33.19 v50.03,33.19 | v44.11,30.32 v45.33,30.32 | v50.06,76.42 v44.11,76.42 | v51.68,88.1 v50.87,88.1 | v55.75,90.44 56.13,90.06 64.08,90.06 v64.46,90.44 | v64.46,86.53 64.84,86.91 69.01,86.91 69.97,85.94 69.97,85.23 72.49,85.23 72.89,84.82 73.91,84.82 73.93,84.8 v76.96,84.8 | v78.99,91.99 v76.96,91.99 | v87.22,94.48 v85.8,94.48 | v91.28,79.44 93.26,79.44 93.65,79.06 94.51,79.06 96.26,77.31 101.19,77.31 101.72,76.77 v102.69,76.77 | v102.69,73.04 106.95,73.04 108.5,74.59 116.73,74.59 117.14,74.18 117.8,74.18 118.21,74.59 130.86,74.59 130.88,74.56 131.85,74.56 131.87,74.59 137,74.59 137.38,74.21 141.45,74.21 141.5,74.16 146.5,74.16 147.31,74.97 147.97,74.97 148.38,74.56 152.19,74.56 153.28,75.65 153.28,75.73 153.77,76.21 154.43,76.21 154.66,75.98 157.17,75.98 157.83,76.65 159.91,76.65 161.51,75.04 161.51,66.79 161.11,66.38 161.11,59.63 161.51,59.22 161.51,52.69 v153.59,52.69
!IOT621  (via drill 0.61)
  Top 0.203: v57.07,83.15 57.47,82.74 v57.47,77.61 | v70.71,82.56 v70.71,79.67 | v84.37,82.26 84.78,81.85 84.78,71.69 v84.37,71.28 | v89.38,65.75 v89.38,71.28 | v117.88,63.51 117.47,63.11 117.47,57.01 v117.88,56.6
  Bottom 0.203: v57.07,83.15 59.02,83.15 IC10.5 | v57.47,77.61 57.78,77.31 61.34,77.31 63.44,79.41 70.45,79.41 v70.71,79.67 | v70.71,82.56 73.6,82.56 73.91,82.26 76.35,82.26 76.63,82.54 81.25,82.54 81.53,82.26 v84.37,82.26 | v89.38,71.28 v84.37,71.28 | v89.38,65.75 103.22,65.75 103.73,65.24 107.23,65.24 107.64,64.83 108.22,64.83 109.85,63.21 117.57,63.21 v117.88,63.51 | v117.88,56.6 IC22.5
!IOT622  (via drill 0.61)
  Top 0.203: v100.66,83.3 100.58,83.22 100.58,81.17 100.71,81.04 100.71,61.12 | v100.71,56.88 100.71,61.12 | v66.72,73.93 66.31,74.33 66.31,79.49 66.72,79.9 66.72,80.51 IC10.9 | v88.51,66.61 v88.51,73.93 | v93.19,61.51 v93.19,66.56 | v100.63,61.12 100.71,61.12
  Bottom 0.203: v100.66,83.3 98.57,83.3 IC20.11 | v100.71,56.88 104.49,56.88 IC24.5 | v66.72,73.93 67.1,74.31 88.13,74.31 v88.51,73.93 | v88.51,66.61 88.54,66.59 89.71,66.59 90.04,66.26 92.88,66.26 v93.19,66.56 | v93.19,61.51 97.33,61.51 97.71,61.12 v100.63,61.12
!IOT624  (via drill 0.61)
  Top 0.203: v62.53,34.15 v62.53,35.75 | IC8.1 58.9,69.15 58.57,68.82 58.57,46.17 60.19,44.54 IC1.1 | v78.25,50.18 77.85,49.77 77.85,37.81 78.33,37.33 v78.33,36.21 | v69.84,36.21 69.84,35.5 69.23,34.89 69.23,34.28 69.11,34.15 IC1.19
  Bottom 0.203: v62.53,35.75 61.11,35.75 IC1.1 | v62.53,34.15 66.52,34.15 IC1.19 | v78.25,50.18 80.82,50.18 81.15,50.51 89.86,50.51 90.19,50.84 100.02,50.84 101.75,52.57 102.13,52.57 102.13,53.02 104.19,55.08 112.14,55.08 112.49,54.72 IC24.11 | v69.84,36.21 v78.33,36.21
!LAD  (via drill 0.61)  (1 unrouted)
  Top 0.203: 81.71,70.32 81.71,55.28 82.14,54.85 IC12.11 | 81.71,70.32 81.71,77.56 IC3.8 | v31.77,44.62 31.36,45.02 31.36,68.44 v31.77,68.85 | v48.84,68.85 48.84,78.85 49.65,79.67 49.65,82.41 50.06,82.82 v50.06,86.14 | v84.2,86.96 84.2,83.6 85.19,82.61 85.19,70.93 84.78,70.52 v84.78,70.07 | 81.71,70.32 v82.11,70.32 | v107.72,50.79 v107.72,55.89 | v102.94,55 v102.94,50.81
  Bottom 0.203: v31.77,44.62 21.79,44.62 21.76,44.59 16.25,44.59 15.87,44.21 IC13.11 | v48.84,68.85 v31.77,68.85 | v50.06,86.14 52.27,86.14 52.7,86.58 58.92,86.58 59.28,86.93 61.82,86.93 61.84,86.91 62.5,86.91 62.94,87.34 72.23,87.34 72.56,87.01 73.22,87.01 73.55,87.34 78.56,87.34 78.66,87.24 79.32,87.24 79.42,87.34 83.81,87.34 v84.2,86.96 | v84.78,70.07 84.53,70.32 v82.11,70.32 | v107.72,55.89 108.02,55.59 128.62,55.59 128.65,55.61 129.87,55.61 129.89,55.59 141.04,55.59 141.42,55.97 IC7.10 | v107.72,50.79 107.44,50.51 103.25,50.51 v102.94,50.81 | v102.94,55 99.82,55 IC11.11
!OE  (via drill 0.61)
  Top 0.203: v82.93,37.78 v82.93,36.16 | v72.82,80.1 v72.82,67.37 | v47.62,57.42 47.62,54.47 48.03,54.06 48.03,40.25 47.62,39.84 47.62,39.13 48.03,38.72 v48.03,38.27 48.2,37.76 v48.2,30.32 | v50.06,67.96 v50.06,57.42 | v55.72,68.8 55.72,70.42 v55.75,70.45 | v62.94,67.17 v62.94,69.74 | v38.48,38.27 IC17.20 | v65.38,40.5 64.97,40.09 64.97,33.49 65.78,32.68 v65.78,28.51 | v54.63,26.61 55.04,27.01 55.04,29.91 v54.63,30.32
  Bottom 0.203: v82.93,36.16 87.57,36.16 IC9.19 | v82.93,37.78 82.19,37.78 IC9.1 79.88,38.62 67.48,38.62 66.9,39.21 66.9,40.5 v65.38,40.5 | v72.82,67.37 68.91,67.37 IC8.19 66.52,67.17 v62.94,67.17 | v72.82,80.1 73.98,80.1 IC3.6 | v48.03,38.27 v38.48,38.27 | v50.06,57.42 v47.62,57.42 | v50.06,67.96 50.08,67.98 51.89,67.98 52.7,68.8 v55.72,68.8 | v55.75,70.45 61.87,70.45 62.58,69.74 v62.94,69.74 | v65.78,28.51 61.95,28.51 60.7,27.27 59.18,27.27 58.52,26.61 v54.63,26.61 | v48.2,30.32 v54.63,30.32
!SCL  (via drill 0.61)
  Top 0.203: v103.5,90.62 v103.5,81.5 | v107.56,90.62 v107.56,88.99 | v145.92,63.95 145.92,42.18 IC25.13 | v140.41,64.86 v140.41,66.13 | v123.46,87.72 123.74,87.44 123.74,80.1 123.34,79.69 123.34,69.81 v123.74,69.41 | v133.8,69.41 133.8,67.4 IC7.1
  Bottom 0.203: v103.5,81.5 98.22,81.5 IC20.10 | v103.5,90.62 104.24,90.62 IC18.1 106.83,90.62 v107.56,90.62 | v107.56,88.99 112.21,88.99 IC18.13 114.09,87.72 v123.46,87.72 | v145.92,63.95 143.66,63.95 IC7.13 141.42,64.86 v140.41,64.86 | v140.41,66.13 135.68,66.13 IC7.1 | v133.8,69.41 v123.74,69.41
!WE  (via drill 0.61)
  Top 0.203: v107.29,37.53 v107.29,35.57 | v28.11,87.97 28.11,89.4 IC27.9 | v24.84,74.82 v24.84,87.97 | v30.4,10.63 30.8,11.04 30.8,18.3 30.14,18.96 v30.14,74.82 | v100.68,41.62 100.68,38.09 IC6.1 | v95.93,42.36 95.98,42.41 95.98,45.02 97.05,46.09 97.05,52.21 96.77,52.49 v96.64,52.49 | v85.36,53.89 85.19,54.06 85.19,64.99 86.81,66.61 86.81,67.88 v87.22,68.29 | v57.75,64.17 58.16,63.77 58.16,54.47 v57.75,54.06 | v50.06,55.64 v50.06,54.39 | v42.54,55.64 42.49,55.69 42.49,58.28 v42.54,58.33 | v33.6,58.64 34.01,59.04 34.01,66.28 33.6,66.69 33.6,70.27 33.19,70.68 v33.19,74.74
  Bottom 0.203: v107.29,35.57 108.33,35.57 IC6.19 | IC6.1 103.27,37.53 v107.29,37.53 107.49,37.02 107.69,36.82 122.45,36.82 122.91,36.36 125.01,36.36 125.42,35.95 128.52,35.95 129.05,36.49 129.05,37.1 128.52,37.63 125.37,37.63 IC2.1 | v24.84,87.97 v28.11,87.97 | SV3.9 24.76,74.89 v24.84,74.82 v30.14,74.82 30.63,74.74 v33.19,74.74 | IC17.39 52.8,88.76 52.45,89.12 31.75,89.12 31.52,88.89 29.18,88.89 28.85,89.22 IC27.9 | v30.4,10.63 R2.1 | v100.68,41.62 96.67,41.62 v95.93,42.36 | v96.64,52.49 95.58,53.56 89.99,53.56 89.66,53.89 v85.36,53.89 | v87.22,68.29 82.88,68.29 82.85,68.26 82.39,68.26 80.89,66.76 80.89,66.56 80.82,66.56 80.41,66.15 78.38,66.15 78.35,66.18 77.69,66.18 77.26,65.75 74.06,65.75 73.68,66.13 71.7,66.13 71.17,65.6 71.17,63.36 64.08,63.36 63.67,63.77 61.64,63.77 61.23,63.36 58.57,63.36 v57.75,64.17 | v57.75,54.06 50.39,54.06 v50.06,54.39 | v50.06,55.64 50.03,55.66 42.56,55.66 v42.54,55.64 | v42.54,58.33 42.23,58.64 v33.6,58.64
!WR1  (via drill 0.61)
  Top 0.203: v3.81,58.89 3.81,61.76 IC26.1 | v5.13,58.89 5.13,58.1 IC4.15 | v4.44,64.02 SV3.1
  Bottom 0.203: v5.13,58.89 v3.81,58.89 | v4.44,64.02 4.42,64 3.45,64 IC26.1
!WR2  (via drill 0.61)
  Top 0.203: v6.34,58.89 6.34,61.76 IC26.2 5.43,64 v5.43,68.29 | v7.67,58.89 7.67,58.1 IC4.14 | v2.97,72.35 v2.97,77.43
  Bottom 0.203: v7.67,58.89 v6.34,58.89 | v2.97,72.35 3.37,71.95 3.58,71.95 4.69,70.83 4.69,68.29 v5.43,68.29 | v2.97,77.43 SV3.2
!WR3  (via drill 0.61)
  Top 0.203: v8.88,58.89 8.88,61.76 IC26.3 | v10.21,58.89 10.21,58.1 IC4.13 | v6.98,64.02 SV3.3
  Bottom 0.203: v10.21,58.89 v8.88,58.89 | v6.98,64.02 7,64 7.97,64 IC26.3
!WR4  (via drill 0.61)
  Top 0.203: v11.42,58.89 11.42,61.76 IC26.4 11.42,63.64 11.83,64.05 11.83,73.01 v12.24,73.42 | v12.75,58.89 12.75,58.1 IC4.12 | v5.86,73.42 5.86,76.72 6.24,77.1 SV3.4
  Bottom 0.203: v12.75,58.89 v11.42,58.89 | v12.24,73.42 v5.86,73.42
!WR5  (via drill 0.61)
  Top 0.203: v13.96,58.89 13.96,61.76 IC26.5 | v15.29,58.89 15.29,58.1 IC4.11 | v9.52,64.33 SV3.5
  Bottom 0.203: v15.29,58.89 v13.96,58.89 | v9.52,64.33 12.72,64.33 13.05,64 IC26.5
!WR6  (via drill 0.61)
  Top 0.203: v16.51,58.89 16.51,61.76 IC26.6 15.23,63.64 14.85,64.02 v14.85,72.35 | v17.9,58.89 17.9,58.18 IC4.10 | v10.61,72.35 10.64,72.38 10.64,76.72 10.26,77.1 SV3.6
  Bottom 0.203: v17.9,58.89 v16.51,58.89 | v14.85,72.35 v10.61,72.35
!WR7  (via drill 0.61)
  Top 0.203: SV3.7 11.42,74.46 11.42,71.26 IC26.11 11.42,69.38 11.42,65.55 v11.02,65.14 | v21.31,65.14 21.31,57.82 IC4.9
  Bottom 0.203: v11.02,65.14 v21.31,65.14
!WR8  (via drill 0.61)
  Top 0.203: v8.4,76.31 8.4,71.62 IC26.12 | v19.4,68.69 v19.4,50.61
  Bottom 0.203: v8.4,76.31 11.4,76.31 11.75,76.67 SV3.8 | v19.4,50.61 18.46,50.61 18.41,50.56 IC4.7 | v19.4,68.69 8.86,68.69 8.53,69.03 IC26.12
BAC0  (1 unrouted)
BAC1  (via drill 0.61)  (1 unrouted)
  Top 0.203: v9.04,19.39 9.04,24.73 9.44,25.13 9.44,28.66 9.16,28.94 v9.16,40.4
  Bottom 0.203: v9.04,19.39 5.79,19.39 5.46,19.06 IC15.15 | v9.16,40.4 17.47,40.4 17.95,40.88 17.95,41.57 IC13.10
BAC2  (via drill 0.61)
  Top 0.203: v3.55,32.22 3.55,34.33 IC13.1 2.36,36.28 2.36,40.7 1.14,41.92 1.14,71.69 2.56,73.11 2.56,76.67 2.15,77.08 2.15,77.79 4.75,80.38 4.75,83.78 7.87,86.91 7.87,99.38 v7.95,99.45 | v20.44,32.22 20.44,31.51 IC14.9 | v119.98,9.87 120.01,9.89 120.01,10.81 119.88,10.94 119.88,11.72 119.48,12.13 119.48,18.96 119.5,18.99 119.5,24.85 119.6,24.96 119.6,25.67 119.2,26.07 v119.2,34.66 | v136.34,33.34 136.34,36.36 137.18,37.2 137.18,37.99 138.07,38.88 v138.07,41.64 | v134.26,43.27 v134.26,41.64 | v130.25,47.51 v130.25,43.27 | v107.36,46.14 v107.36,47.94 | v102.89,44.92 102.48,45.33 102.48,47.79 102.89,48.2 102.89,49.11 101.72,50.28 101.72,52.9 v101.32,53.3 | v100.02,53.3 96.64,53.3 96.64,62.19 98.17,63.72 100.3,63.72 100.3,67.83 98.73,69.41 v98.73,70.07 | v93.39,76.75 v93.39,70.07 | v77.77,98.62 v77.77,77.84 | v124.45,9.05 SV1.22
  Bottom 0.203: v20.44,32.22 v3.55,32.22 | v124.45,9.05 124.33,8.93 120.92,8.93 v119.98,9.87 | v119.2,34.66 122.65,34.66 123.06,34.25 126.41,34.25 126.82,34.66 130.27,34.66 130.68,34.25 133.37,34.25 134.28,33.34 v136.34,33.34 | v138.07,41.64 138.04,41.67 134.28,41.67 v134.26,41.64 | v134.26,43.27 134.08,43.09 130.42,43.09 v130.25,43.27 | v130.25,47.51 130.22,47.54 123.74,47.54 123.34,47.94 v107.36,47.94 | v107.36,46.14 106.98,45.76 105.81,45.76 104.97,44.92 v102.89,44.92 | v100.02,53.3 v101.32,53.3 | v93.39,70.07 v98.73,70.07 | v93.39,76.75 90.65,76.75 90.22,77.18 79.24,77.18 78.58,77.84 v77.77,77.84 | v77.77,98.62 34.49,98.62 32.84,100.27 8.76,100.27 v7.95,99.45
BAC3  (via drill 0.61)  (1 unrouted)
  Top 0.203: v17.14,41.24 17.14,31.51 17.52,31.13 IC14.10
  Bottom 0.203: v17.14,41.24 6.04,41.24 5.71,41.57 IC13.15
BAC4  (via drill 0.61)
  Top 0.203: v78.66,51.4 78.66,64.38 78.84,64.55 78.84,67.12 78.43,67.53 v78.43,72.15 | v55.62,72.15 55.34,72.43 55.34,73.52 55.32,73.55 55.32,74.97 55.34,74.99 55.34,75.81 54.73,76.42 51.68,76.42 v51.68,75.55 | v42.9,75.3 43.3,74.89 43.3,64.61 v42.9,64.2 | v32.18,64.2 31.77,63.79 31.77,46.65 v32.18,46.24 | v29.33,46.24 29.74,45.83 29.74,29.58 v29.33,29.17 | v23.74,26.33 v23.74,29.17 | v3.17,26.33 3.17,23.89 IC14.1 | v128.19,36.79 128.85,36.13 128.85,30.95 129.26,30.54 129.26,16.88 129.13,16.75 129.13,14.21 128.72,13.8 128.72,7.99 128.8,7.91 SV1.26 | v102.89,43.27 v102.89,41.36 | v100.4,43.27 100.4,42.91 99.46,41.97 99.36,41.97 99,41.62 98.32,41.62 98.32,39.71 98.45,39.59 98.45,38.88 98.01,38.44 98.01,36.79 97.61,36.39 97.61,34.89 97.25,34.53 97.25,33.8 97.66,33.39 97.66,15.91 96.79,15.05 96.79,13.27 96.64,13.12 v96.62,13.12 | v88.51,12.13 87.65,11.27 85.26,11.27 85.26,13.7 85.39,13.83 v85.39,17.54 | v84.17,19.6 v84.17,17.54 | v74.93,20 74.93,23.61 75.33,24.02 75.33,24.73 74.93,25.13 74.93,29.53 76.63,31.23 76.63,37.4 77.03,37.81 77.03,45.05 v76.63,45.45 | v82.52,45.45 82.52,48.83 IC12.9
  Bottom 0.203: v78.66,51.4 77.44,51.4 77.44,49.82 77.92,49.34 82.14,49.34 IC12.9 | v55.62,72.15 v78.43,72.15 | v51.68,75.55 51.43,75.3 v42.9,75.3 | v32.18,64.2 v42.9,64.2 | v29.33,46.24 v32.18,46.24 | v23.74,29.17 v29.33,29.17 | v3.17,26.33 v23.74,26.33 | v128.19,36.79 123.06,36.79 122.35,37.5 111.78,37.5 111.22,38.06 111.22,38.77 110.66,38.77 110.61,38.82 110.13,38.82 108.89,40.07 105.76,40.07 105.05,40.78 103.48,40.78 v102.89,41.36 | v100.4,43.27 v102.89,43.27 | v96.62,13.12 95.93,13.12 95.75,12.94 93.47,12.94 93.06,12.54 92.65,12.54 92.25,12.13 v88.51,12.13 | v84.17,17.54 v85.39,17.54 | v84.17,19.6 82.24,19.6 81.91,19.27 79.88,19.27 79.14,20 v74.93,20 | v82.52,45.45 v76.63,45.45
BAC5  (via drill 0.61)
  Top 0.203: v132.51,13.58 132.91,13.17 132.91,8.01 132.81,7.91 SV1.28 | v135.53,13.58 135.53,25.59 135.12,26 v135.12,39.33 | v137.26,39.33 136.85,39.74 136.85,64.91 v137.26,65.32 | v130.35,70.88 v130.35,66.26 | v128.39,70.88 126.26,73.01 126.26,78.65 126.61,79.01 126.61,79.72 125.93,80.4 125.93,83.38 126.34,83.78 126.34,89.5 126.28,89.55 126.28,93.23 v126.69,93.64 | v122.83,88.86 v122.83,93.64 | v109.44,88.15 v109.44,90.21 | v91.66,89.88 v91.66,89.06 | v70.38,88.94 69.97,88.53 69.97,86.37 69.57,85.97 69.57,85.53 68.96,84.92 66.16,84.92 66.16,88.79 65.68,89.27 v65.68,91.73 | v41.73,92.01 41.32,91.61 41.32,82.08 40.84,81.6 40.84,72.61 41.24,72.2 | v41.24,69.69 41.24,72.2 | v4.36,55.21 4.36,33.16 4.77,32.75 4.77,31.18 4.82,31.13 IC14.15 | v87.62,51.83 87.7,51.91 87.7,65.34 v87.3,65.75 | v78.02,65.34 78.02,70.5 v77.62,70.9 | v41.65,72.15 41.32,72.15 41.24,72.2
  Bottom 0.203: v135.53,13.58 v132.51,13.58 | v137.26,39.33 v135.12,39.33 | v137.26,65.32 136.88,65.7 131.97,65.7 131.41,66.26 v130.35,66.26 | v128.39,70.88 v130.35,70.88 | v122.83,93.64 v126.69,93.64 | v122.83,88.86 114.68,88.86 114.14,89.4 112.39,89.4 111.58,90.21 v109.44,90.21 | v109.44,88.15 107.36,88.15 106.55,87.34 104.52,87.34 103.83,88.02 103.83,88.28 103.04,89.06 103.02,89.06 102.94,89.14 102.28,89.14 102.2,89.06 98.73,89.06 98.32,89.47 96.24,89.47 95.83,89.06 v91.66,89.06 | v91.66,89.88 82.04,89.88 81.25,89.09 80.59,89.09 80.18,89.5 76.27,89.5 76.12,89.34 70.79,89.34 v70.38,88.94 | v65.68,91.73 65.43,91.99 61.31,91.99 61.28,92.01 v41.73,92.01 | v41.24,69.69 40.86,69.3 32.51,69.3 32.1,69.71 25.93,69.71 22.12,65.9 22.12,64.3 18.84,64.3 18.82,64.33 18,64.33 17.39,63.72 17.39,59.73 18.23,59.73 19.17,58.79 19.17,55.21 v4.36,55.21 | v87.62,51.83 84.73,51.83 IC12.10 | v87.3,65.75 87.27,65.72 78.41,65.72 v78.02,65.34 | v77.62,70.9 56.46,70.9 56.05,71.31 55.29,71.31 54.86,71.74 52.39,71.74 52.01,71.36 51.35,71.36 50.57,72.15 v41.65,72.15
BAC6  (via drill 0.61)
  Top 0.203: v155.98,30.39 155.98,27.22 IC16.10 | v139.72,30.39 140.13,30.8 140.13,40.02 v139.72,40.42 | v127.33,44.72 v127.33,40.58 | v122.45,44.72 122.45,52.13 v122.04,52.54 | v103.81,55.87 v103.81,52.92 | v80.08,55.87 80.49,56.27 80.49,66.59 v80.08,66.99 | v135.73,1.94 135.73,6.87 135.35,7.25 SV1.30 | v146.1,1.94 146.1,10.15 v146.5,10.55 | v147.31,15.66 v147.31,10.55 | v150.8,15.66 150.39,16.07 150.39,27.95 150.8,28.36 150.8,30.39 v150.77,30.42
  Bottom 0.203: v139.72,30.39 150.77,30.39 | 150.77,30.39 v155.98,30.39 | v139.72,40.42 139.57,40.58 v127.33,40.58 | v122.45,44.72 v127.33,44.72 | v122.04,52.54 118.82,52.54 118.61,52.34 114.62,52.34 114.04,52.92 v103.81,52.92 | v80.08,55.87 v103.81,55.87 | v80.08,66.99 77.11,66.99 IC12.1 | v135.73,1.94 136.55,1.13 145.28,1.13 v146.1,1.94 | v147.31,10.55 v146.5,10.55 | v150.8,15.66 v147.31,15.66 | v150.77,30.42 150.77,30.39
BAC7  (via drill 0.61)
  Top 0.203: 139.17,13.39 139.37,13.58 140.74,13.58 140.74,17.67 IC16.1 | 139.17,13.39 v138.48,12.69 | v137.16,12.69 SV1.32 | v103.75,63.95 103.75,68.8 103.5,69.05 v103.5,78.93 | v110.48,78.91 110.43,78.85 110.43,77.13 110.84,76.72 110.84,74.46 111.83,73.47 v111.83,72.89 | v118.38,65.27 v118.38,72.89 | v131.16,65.34 130.75,64.94 130.75,55.89 131.16,55.49 131.16,51.32 v131.57,50.91 | v139.72,50.91 139.72,41.59 138.81,40.68 138.81,34.3 138.3,33.8 v138.3,23.2 | v139.11,23.2 139.11,13.45 139.17,13.39
  Bottom 0.203: v138.48,12.69 v137.16,12.69 | v103.75,63.95 103.53,63.72 88.16,63.72 86.91,64.96 84.73,64.96 IC12.15 | v103.5,78.93 103.75,79.19 110.21,79.19 v110.48,78.91 | v118.38,72.89 v111.83,72.89 | v118.38,65.27 118.46,65.34 v131.16,65.34 | v131.57,50.91 131.95,50.53 133.73,50.53 133.75,50.51 134.39,50.51 134.41,50.53 139.34,50.53 v139.72,50.91 | v139.11,23.2 v138.3,23.2
BAC8  (via drill 0.61)
  Top 0.203: v142.16,42.46 142.16,28.05 v142.62,27.6 | v98.67,42.46 IC11.9 | v142.87,12.71 142.87,24.93 143.25,25.31 IC16.15 | v139.69,12.71 SV1.34
  Bottom 0.203: v142.16,42.46 v98.67,42.46 | v142.62,27.6 142.64,27.57 143.63,27.57 IC16.15 | v142.87,12.71 v139.69,12.71
BAC9  (1 unrouted)
BAC10  (1 unrouted)
BAC11  (via drill 0.61)
  Top 0.203: v97.53,71.31 97.45,71.23 97.45,70.88 97.05,70.47 97.05,66.87 97.45,66.46 97.45,65.09 IC11.15 | v98.7,71.31 99.06,71.67 99.06,73.9 99.08,73.93 99.08,75.91 99.49,76.31 99.49,79.92 99,80.4 v99,82.31 | v101.39,82.31 101.47,82.39 101.47,86.93 100.98,87.41 100.98,94.3 101.49,94.81 v101.49,95.87 | v105.02,95.87 106.09,94.81 106.09,93.26 108.15,91.2 v108.71,91.2 | v111.12,94.55 v111.12,91.2 | v116.99,92.82 v116.99,94.55 | v128.95,90.23 v128.95,92.82 | v136.44,38.42 v136.44,90.23 | v151.02,38.37 150.62,37.96 150.62,31.43 149.96,30.77 149.96,27.98 149.98,27.95 v149.98,7.58
  Bottom 0.203: v98.7,71.31 v97.53,71.31 | v101.39,82.31 v99,82.31 | v105.02,95.87 v101.49,95.87 | v111.12,91.2 v108.71,91.2 | v116.99,94.55 v111.12,94.55 | v128.95,92.82 v116.99,92.82 | v136.44,90.23 v128.95,90.23 | v136.44,38.42 146.35,38.42 146.4,38.37 147.7,38.37 147.75,38.42 148.43,38.42 148.48,38.37 v151.02,38.37 | SV1.40 v149.98,7.58
BIOP1  (via drill 0.61)
  Top 0.203: v116.86,3.16 117.01,3.01 117.01,1.92 117.8,1.13 118.74,1.13 v118.74,3.09 | v130.65,13.47 v130.65,3.09 | v120.72,12.41 120.72,16.6 120.42,16.9 120.42,17.16 120.01,17.56 120.01,18.27 120.31,18.58 v120.31,20.21 | v116.66,20.23 116.66,41.16 116.25,41.57 116.25,43.12 115.84,43.52 115.84,46.65 115.44,47.05 115.44,51.09 115.03,51.5 115.03,51.93 113.91,53.05 111.63,53.05 111.63,59.4 112.49,60.26 116.25,60.26 116.25,66.08 v115.84,66.48 | v111.76,3.09 SV1.11
  Bottom 0.203: v111.76,3.09 116.78,3.09 v116.86,3.16 | v130.65,3.09 v118.74,3.09 | v130.65,13.47 130.58,13.55 125.29,13.55 123.82,12.08 121.05,12.08 v120.72,12.41 | v120.31,20.21 119.93,19.82 117.06,19.82 v116.66,20.23 | v115.84,66.48 118.72,66.48 IC22.1
BIOP2  (via drill 0.61)
  Top 0.203: v110.56,1.94 111.78,1.94 112.87,3.04 112.87,4.03 113.56,4.71 SV1.13 | v107.89,3.92 v107.89,1.94 | v102.59,3.92 100.98,2.32 100.98,1.92 100.2,1.13 79.5,1.13 79.5,3.37 78.94,3.92 78.84,3.92 v78.84,6.57 | v76.35,15.89 v76.35,6.46 | v93.87,18 93.54,18.33 93.54,43.78 93.14,44.18 93.14,45.83 93.31,46.01 93.31,49.52 93.72,49.92 93.72,54.65 v93.31,55.06 | v95.83,60.67 v95.83,55.06 | v103.91,60.95 103.91,61.58 104.16,61.84 104.16,62.09 105.28,63.21 107.41,63.21 107.41,65.06 107.08,65.39 107.08,66.48 IC24.1
  Bottom 0.203: v107.89,1.94 v110.56,1.94 | v107.89,3.92 104.49,3.92 104.47,3.95 103.81,3.95 103.78,3.92 v102.59,3.92 | v78.84,6.57 78.73,6.46 v76.35,6.46 | v76.35,15.89 79.55,15.89 79.95,16.29 87.4,16.29 87.83,16.73 92.6,16.73 v93.87,18 | v95.83,55.06 v93.31,55.06 | v95.83,60.67 99.92,60.67 100.3,60.29 103.25,60.29 v103.91,60.95
BIOP4  (1 unrouted)
BMB0  (via drill 0.61)
  Top 0.203: v118.26,12.28 118.26,5.75 118.64,5.37 SV1.17 | v105.56,12.28 105.56,17.23 104.92,17.87 104.92,25.26 105.33,25.67 v105.33,27.45 | v107.36,27.45 106.95,27.85 106.95,31.94 106.12,32.78 v106.12,35.01
  Bottom 0.203: v105.56,12.28 v118.26,12.28 | v107.36,27.45 v105.33,27.45 | v106.12,35.01 103.27,35.01 IC6.2
BMB1  (via drill 0.61)
  Top 0.203: v104.92,29.91 104.52,29.5 104.52,11.59 v104.92,11.19 | v120.8,11.19 120.8,5.75 121.18,5.37 SV1.19
  Bottom 0.203: v104.92,29.91 103.27,29.91 IC6.4 | v120.8,11.19 v104.92,11.19
BMB2  (via drill 0.61)
  Top 0.203: v123.34,9.77 123.34,5.75 123.72,5.37 SV1.21 | v121.64,9.77 121.64,16.27 120.82,17.08 v120.82,17.92 | v105.73,18.23 105.33,18.63 105.33,24.5 v105.73,24.91
  Bottom 0.203: v121.64,9.77 v123.34,9.77 | v120.82,17.92 120.24,18.5 106.02,18.5 v105.73,18.23 | v105.73,24.91 103.27,24.91 IC6.6
BMB3  (via drill 0.61)
  Top 0.203: v80.11,92.8 80.11,89.57 80.51,89.17 80.51,77.61 80.89,77.23 v80.89,53.05 | v89.33,53.05 89.33,45.63 v90.29,44.67 | v100.35,36.82 100.35,32.32 101.47,31.2 103.7,31.2 103.7,22.26 103.27,21.83 103.27,20.31 IC6.8 | v117.85,2.25 v117.85,3.92 | v100.17,2.27 100.17,7.99 99.87,8.29 v99.87,20.21
  Bottom 0.203: v80.11,92.8 80.08,92.82 75.89,92.82 IC3.1 | v89.33,53.05 v80.89,53.05 | v90.29,44.67 92.5,44.67 95.12,42.05 95.12,41.11 96.82,39.41 96.82,38.39 98.78,38.39 v100.35,36.82 | v117.85,3.92 126.34,3.92 126.69,4.28 SV1.23 | v117.85,2.25 111.43,2.25 110.89,2.78 104.97,2.78 104.47,2.27 v100.17,2.27 | v99.87,20.21 100.68,20.21 IC6.8
BMB4  (via drill 0.61)